# EAGLE design SENSOR GARIS (EAGLE 7.2.0)
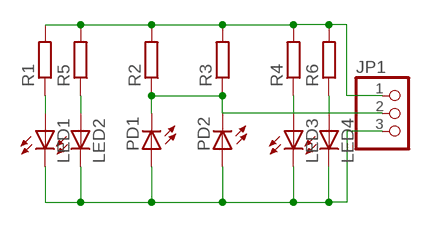
[diagram p0: schematic, sheet 1]

## Parts
JP1  PINHD-1X3  [1X03]
LED1  LED3MM  [LED3MM]
LED2  LED3MM  [LED3MM]
LED3  LED3MM  [LED3MM]
LED4  LED3MM  [LED3MM]
PD1  LED3MM  [LED3MM]
PD2  LED3MM  [LED3MM]
R1  R-EU_M0805  [M0805]
R2  R-EU_M0805  [M0805]
R3  R-EU_M0805  [M0805]
R4  R-EU_M0805  [M0805]
R5  R-EU_M0805  [M0805]
R6  R-EU_M0805  [M0805]

## Nets
N$1: JP1.3 LED1.K(C) LED2.K(C) LED3.K(C) LED4.K(C) PD1.A PD2.A
N$2: LED1.A R1.1
N$3: JP1.2 PD1.K(C) PD2.K(C) R2.1 R3.1
N$5: LED2.A R5.1
N$7: LED3.A R4.1
N$8: LED4.A R6.1
N$9: JP1.1 R1.2 R2.2 R3.2 R4.2 R5.2 R6.2

## Library data of the parts
JP1 = pinhead:PINHD-1X3: PIN HEADER
LED1-LED4 PD1 PD2 = led:LED: LED OSRAM: - CHIPLED LG R971, LG N971, LY N971, LG Q971, LY Q971, LO R971, LY R971 LH N974, LH R974 LS Q976, LO Q976, LY Q976 LO Q996 - Hyper CHIPLED LW Q18S LB Q993, LB Q99A, LB R99A - SideLED LS A670, LO A670, LY A670, LG A670, LP A670 LB A673, LV A673, LT A673, LW A673 LH A674 LY A675 LS A676, LA A676, LO A676, LY A676, LW A676 LS A679, LY A679, LG A679 - Hyper Micro SIDELED® LS Y876, LA Y876, LO Y876, LY Y876 LT Y87S - SmartLED LW L88C, LW L88S LB L89C, LB L89S, LG L890 LS L89K, LO L89K, LY L89K LS L896, LA L896, LO L896, LY L896 - TOPLED LS T670, LO T670, LY T670, LG T670, LP T670 LSG T670, LSP T670, LSY T670, LOP T670, LYG T670 LG T671, LOG T671, LSG T671 LB T673, LV T673, LT T673, LW T673 LH T674 LS T676, LA T676, LO T676, LY T676, LB T676, LH T676, LSB T676, LW T676 LB T67C, LV T67C, LT T67C, LS T67K, LO T67K, LY T67K, LW E67C LS E67B, LA E67B, LO E67B, LY E67B, LB E67C, LV E67C, LT E67C LW T67C LS T679, LY T679, LG T679 LS T770, LO T770, LY T770, LG T770, LP T770 LB T773, LV T773, LT T773, LW T773 LH T774 LS E675, LA E675, LY E675, LS T675 LS T776, LA T776, LO T776, LY T776, LB T776 LHGB T686 LT T68C, LB T68C - Hyper Mini TOPLED® LB M676 - Mini TOPLED Santana® LG M470 LS M47K, LO M47K, LY M47K Source: http://www.osram.convergy.de LUXEON: - LUMILED® LXK2-PW12-R00, LXK2-PW12-S00, LXK2-PW14-U00, LXK2-PW14-V00 LXK2-PM12-R00, LXK2-PM12-S00, LXK2-PM14-U00 LXK2-PE12-Q00, LXK2-PE12-R00, LXK2-PE12-S00, LXK2-PE14-T00, LXK2-PE14-U00 LXK2-PB12-K00, LXK2-PB12-L00, LXK2-PB12-M00, LXK2-PB14-N00, LXK2-PB14-P00, LXK2-PB14-Q00 LXK2-PR12-L00, LXK2-PR12-M00, LXK2-PR14-Q00, LXK2-PR14-R00 LXK2-PD12-Q00, LXK2-PD12-R00, LXK2-PD12-S00 LXK2-PH12-R00, LXK2-PH12-S00 LXK2-PL12-P00, LXK2-PL12-Q00, LXK2-PL12-R00 Source: www.luxeon.com KINGBRIGHT: KA-3528ASYC Source: www.kingbright.com
R1-R6 = rcl:R-EU_: RESISTOR, European symbol

## Board
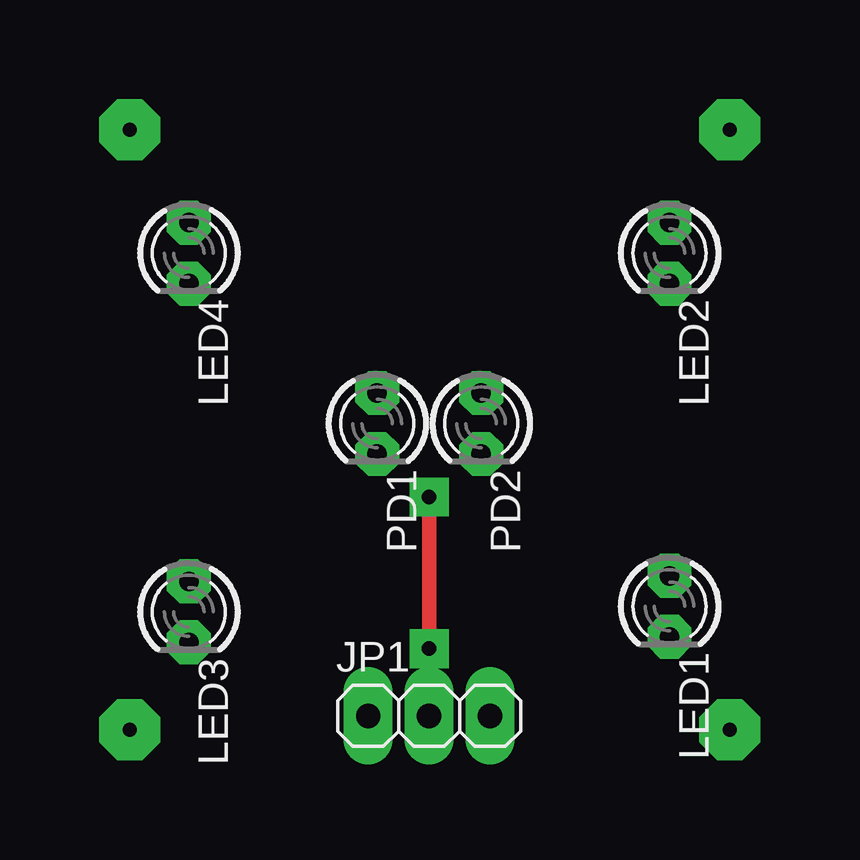
[diagram p1: board, top side]
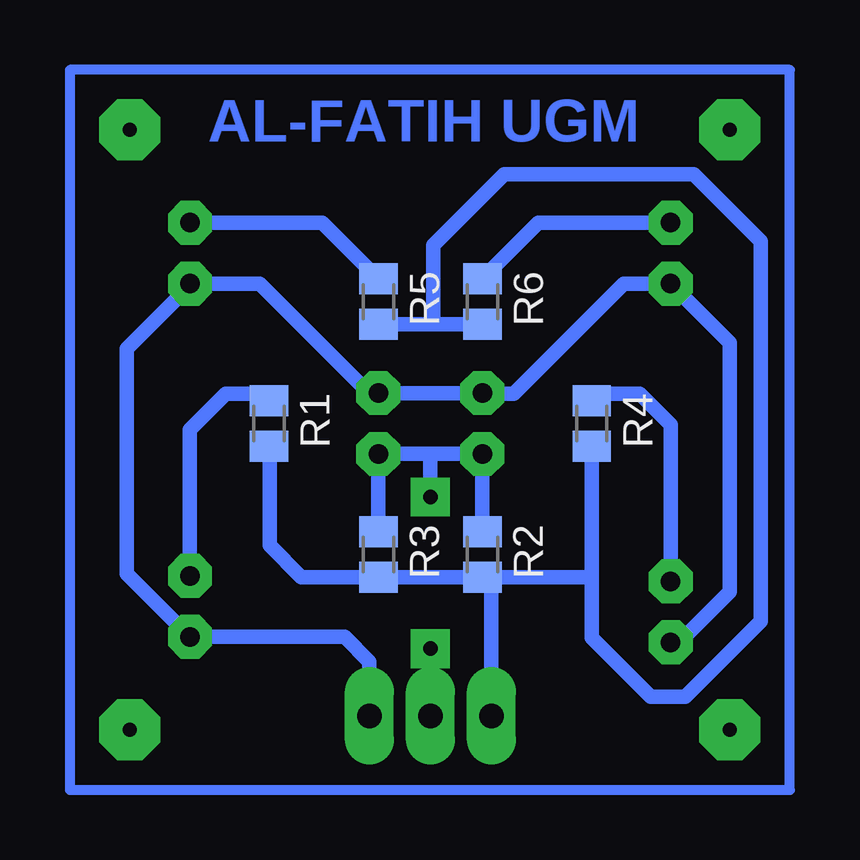
[diagram p2: board, bottom side, seen from below]

No outline drawn. Coordinates in mm, seen from the top.
Copper layers (1*16): Top 0.035mm / dielectric 1.5mm / Bottom 0.035mm
Design rules "default *": minimum track width 10mil, minimum drill 24mil, track to track 8mil, track to pad 8mil, pad to pad 8mil, via to via 8mil, smd to smd 8mil, copper to edge 40mil, drill to drill 8mil, minimum pad ring 20mil, minimum via ring 20mil, stop-mask expansion 4mil, vias tented up to drill 0mil, thermal gap 10mil

### Footprints (pad centres in the part's own frame; a part is rotated, then mirrored left to right if it is on the bottom)
1X03 = drill 1.016 long: 1 -2.54,0; 2 0,0; 3 2.54,0
LED3MM = drill 0.813 octagon: A -1.27,0; K 1.27,0
M0805 = smd 1.3 x 1.6: 1 -0.95,0; 2 0.95,0

### Placement (x,y rotation side)
JP1  -25.02,3.08 0 top
LED1  -15.01,7.64 270 top
LED2  -15.01,22.36 270 top
LED3  -35.04,7.41 270 top
LED4  -35.04,22.36 270 top
PD1  -27.19,15.26 270 top
PD2  -22.86,15.26 270 top
R1  -18.3,15.26 270 bottom
R2  -27.19,9.8 270 bottom
R3  -22.86,9.8 270 bottom
R4  -31.75,15.26 270 bottom
R5  -22.86,20.34 270 bottom
R6  -27.19,20.34 270 bottom

### Tracks (layer width: path | path; a pad name or v marks a point on that pad's centre or on a via)
N$1
  Bottom 0.61: JP1.3 -22.48,5.34 -21.46,6.37 -16.51,6.37 | -16.51,6.37 LED1.K | LED3.K -35.39,6.14 -37.5,8.25 -37.5,18.63 LED4.K -33.09,21.09 -28.5,16.5 -27.59,16.5 PD1.A PD2.A -23.2,16.5 -22.5,16.5 -17.91,21.09 LED2.K -15.75,21.08 -15,21 -12.38,18.38 -12.38,9 LED1.K -16.51,6.37
N$2
  Bottom 0.61: LED1.A -15.01,15.01 -16.5,16.5 -18.76,16.5 R1.1
N$3  (via drill 0.6)
  Top 0.61: v-25.02,5.88 v-25.02,12.2
  Bottom 0.61: R3.1 PD2.K -25.02,13.99 | R2.1 PD1.K -25.02,13.99 | v-25.02,12.2 -25.02,13.99 | JP1.2 v-25.02,5.88
N$4
  Bottom 0.406: -40,30 -10,30 -10,0 -40,0 -40,30
N$5
  Bottom 0.61: LED2.A -20.52,23.63 R5.1
N$6  (via drill 0.6 pad 2.54)
  other vias: -37.5,27.5
N$7
  Bottom 0.61: LED3.A -35.04,15.21 -33.75,16.5 -32.04,16.5 R4.1
N$8
  Bottom 0.61: LED4.A -29.53,23.63 R6.1
N$9
  Bottom 0.61: R1.2 -18.12,14.31 -18.33,13.73 -18.33,10.18 -19.66,8.86 R3.2 R2.2 -27.75,8.86 | R6.2 -25.14,19.39 | -25.14,19.39 R5.2 | R4.2 -31.75,9.02 | -31.75,9.02 -31.75,6.34 -34.22,3.87 -35.64,3.87 -38.8,7.03 -38.8,22.85 -36,25.65 -28.09,25.65 -25.14,22.7 -25.14,19.39 | -27.75,8.86 -31.54,8.86 -31.75,9.02 | JP1.1 -27.57,8.66 -27.75,8.86
N$10  (via drill 0.6 pad 2.54)
  other vias: -12.5,27.5
N$11  (via drill 0.6 pad 2.54)
  other vias: -37.5,2.5
N$12  (via drill 0.6 pad 2.54)
  other vias: -12.5,2.5

### Text on the board
Bottom: AL-FATIH UGM